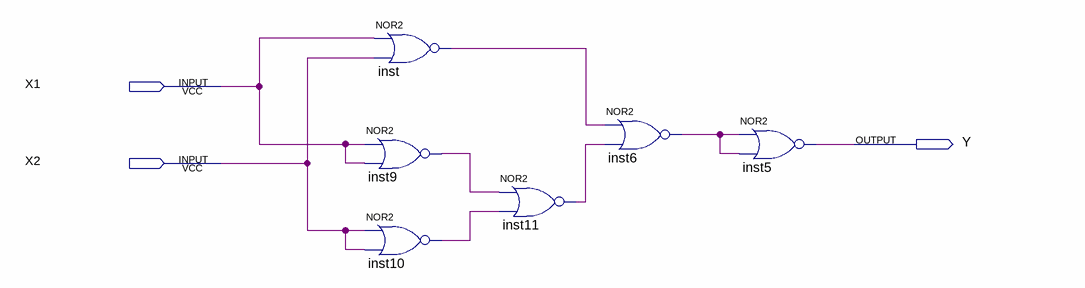
[diagram p0: schematic sheet]
// Quartus schematic Lab_4.bdf as structural Verilog: 6 symbols, 3 pins
module Lab_4 (
  input  X1,
  input  X2,
  output Y
);

  wire inst6_out, inst9_out, inst10_out, inst11_out, inst_out;

  nor inst (inst_out, X1, X2);
  nor inst9 (inst9_out, X1, X1);
  nor inst10 (inst10_out, X2, X2);
  nor inst11 (inst11_out, inst9_out, inst10_out);
  nor inst6 (inst6_out, inst_out, inst11_out);
  nor inst5 (Y, inst6_out, inst6_out);
endmodule
